# Altium schematic sheet MPL3115AltimeterModule.SchDoc
size A; SheetNumber: 14; SheetTotal: 14; ENG_APP_DATE: --/--/--; DSN_APP_DATE: --/--/--; CHK_APP_DATE: --/--/--
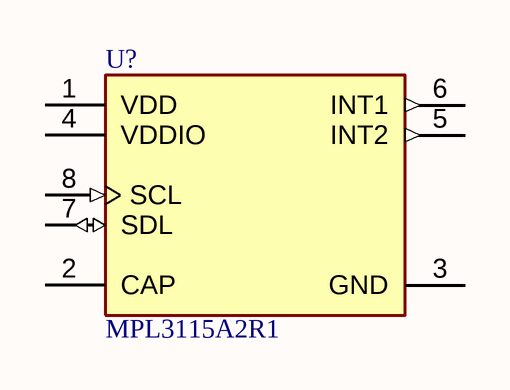
[diagram p0: MPL3115AltimeterModule.SchDoc]

## Parts
U?  MPL3115A2R1  [FP-SOT1768-1-MFG]

## Nets

Not connected (* = marked no-connect by the designer): U? 1(VDD) 2(CAP) 3(GND) 4(VDDIO) 5(INT2) 6(INT1) 7(SDL) 8(SCL)

## Notes on the sheet
- PROJECT
- Drawn:
- Approved:
- APPROVALS
- DATE
- SCALE:
- SIZE
- A
- Title
- FILE NAME
- SHEET
- OF
- REV

## Library data of the parts
U? = CMP-1261-00001-3: IC ALTIMETER I2C VERSION 8LGA; Operating Pressure: 15.95PSI; Max Pressure: 72.52PSI; Nominal Supply Current: 40uA; Max Supply Voltage: 3.6V; Accuracy: 1%; Port Style: No Port; Pressure Type: Absolute; Termination: PCB; Radiation Hardening: No; Number of Pins: 8; Output Type: I2C; Packaging: Tape and Reel; Halogen Free: Halogen Free; Lead Free: Lead Free; Min Operating Temperature: -40°C; Package Quantity: 1000; Weight: 0.001104oz; Case/Package: LGA; Max Operating Temperature: 85°C